# EAGLE design IV51 (EAGLE 6.1)
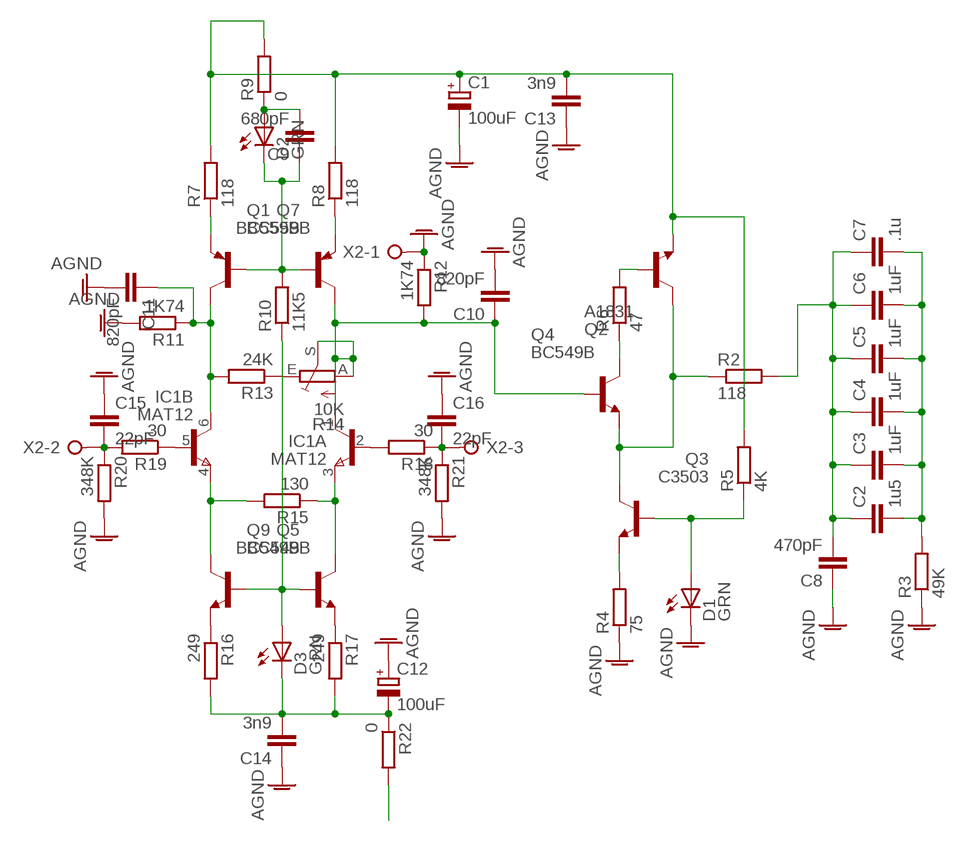
[diagram p0: schematic, sheet 1]

## Parts
C1  100uF  CPOL-EUE5-10.5  [E5-10,5]
C2  1u5  C-EU275-134X316  [C275-134X316]
C3  1uF  C-EU275-134X316  [C275-134X316]
C4  1uF  C-EU275-134X316  [C275-134X316]
C5  1uF  C-EU275-134X316  [C275-134X316]
C6  1uF  C-EU275-134X316  [C275-134X316]
C7  .1u  C-EU050-075X075  [C050-075X075]
C8  470pF  C-EU102-043X133  [C102-043X133]
C9  680pF  C-EU050-045X075  [C050-045X075]
C10  820pF  C-EU075-032X103  [C075-032X103]
C11  820pF  C-EU075-032X103  [C075-032X103]
C12  100uF  CPOL-EUE5-10.5  [E5-10,5]
C13  3n9  C-EUC1210  [C1210]
C14  3n9  C-EUC1210  [C1210]
C15  22pF  C-EU075-032X103  [C075-032X103]
C16  22pF  C-EU075-032X103  [C075-032X103]
D1  GRN  SFH482  [SFH482]
D2  GRN  SFH482  [SFH482]
D3  GRN  SFH482  [SFH482]
IC1  MAT12  MAT-02H  [TO78]
Q1  BC559B  BC559A  [TO92-EBC]
Q2  A1831  2N4923  [TO126]
Q3  C3503  2N4923  [TO126]
Q4  BC549B  [TO92-EBC]
Q5  BC549B  [TO92-EBC]
Q7  BC559B  BC559A  [TO92-EBC]
Q9  BC549B  [TO92-EBC]
R2  118  R-EU_0309/12  [0309/12]
R3  49K  R-EU_0309/12  [0309/12]
R4  75  R-EU_0309/12  [0309/12]
R5  4K  R-EU_0309/12  [0309/12]
R6  47  R-EU_0309/12  [0309/12]
R7  118  R-EU_0309/12  [0309/12]
R8  118  R-EU_0309/12  [0309/12]
R9  0  R-EU_0309/12  [0309/12]
R10  11K5  R-EU_0309/12  [0309/12]
R11  1K74  R-EU_0309/12  [0309/12]
R12  1K74  R-EU_0309/12  [0309/12]
R13  24K  R-EU_0309/12  [0309/12]
R14  10K  TRIM_EU-RJ9W  [RJ9W]
R15  130  R-EU_0309/12  [0309/12]
R16  249  R-EU_R2010  [R2010]
R17  249  R-EU_R2010  [R2010]
R18  30  R-EU_0309/12  [0309/12]
R19  30  R-EU_0309/12  [0309/12]
R20  348K  R-EU_R1210  [R1210]
R21  348K  R-EU_R1210  [R1210]
R22  0  R-EU_0309/12  [0309/12]
X2  W237-3E  [W237-3E]

## Nets
AGND: C1.- C8.1 C10.2 C11.2 C12.+ C13.1 C14.1 C15.1 C16.1 D1.K(C) R3.1 R4.1 R11.2 R12.1 R20.2 R21.2 X2.1
N$2: Q7.E R7.1
N$3: C2.1 C3.1 C4.1 C5.1 C6.1 C7.1 C8.2 R2.2
N$4: D1.A Q3.3(B) R5.1
N$5: C9.2 D2.A R9.1
N$6: Q2.3(B) R6.2
N$7: Q2.2(C) Q3.2(C) Q4.E R2.1
N$8: Q3.1(E) R4.2
N$9: C1.+ C13.2 Q2.1(E) R5.2 R7.2 R8.2 R9.2
N$10: Q4.C R6.1
N$11: Q1.E R8.1
N$12: C10.1 IC1.1(A:C) Q1.C Q4.B R12.2 R14.A R14.S
N$13: C11.1 IC1.6(B:C) Q7.C R11.1 R13.2
N$14: C9.1 D2.K(C) Q1.B Q7.B R10.2
N$15: R13.1 R14.E
N$16: IC1.4(B:E) Q5.C R15.2
N$17: IC1.3(A:E) Q9.C R15.1
N$18: Q5.E R16.1
N$19: Q9.E R17.1
N$20: C12.- C14.2 D3.K(C) R16.2 R17.2 R22.1
N$21: D3.A Q5.B Q9.B R10.1
N$22: IC1.2(A:B) R18.2
N$23: IC1.5(B:B) R19.1
N$24: C15.2 R19.2 R20.1 X2.2
N$25: C16.2 R18.1 R21.1 X2.3
N$28: R22.2
OUT: C2.2 C3.2 C4.2 C5.2 C6.2 C7.2 R3.2

## Library data of the parts
C1 C12 = resistor:CPOL-EU: POLARIZED CAPACITOR, European symbol
C2-C11 C13-C16 = resistor:C-EU: CAPACITOR, European symbol
D1-D3 = led:SFH482: IR LED infrared emitting diode, Infineon
IC1 = linear:MAT-02H: Dual TRANSISTOR
Q1 Q7 = transistor-pnp:BC559*: PNP Transistror
Q2 Q3 = transistor-npn:2N4923: NPN Transistor
Q4 Q5 Q9 = transistor-npn:BC549*: NPN Transistor
R2-R13 R15-R22 = resistor:R-EU_: RESISTOR, European symbol
R14 = pot:TRIM_EU-: POTENTIOMETER
X2 = con-wago-508:W237-3E: WAGO SREW CLAMP; OC_FARNELL: unknown; OC_NEWARK: unknown

## Board
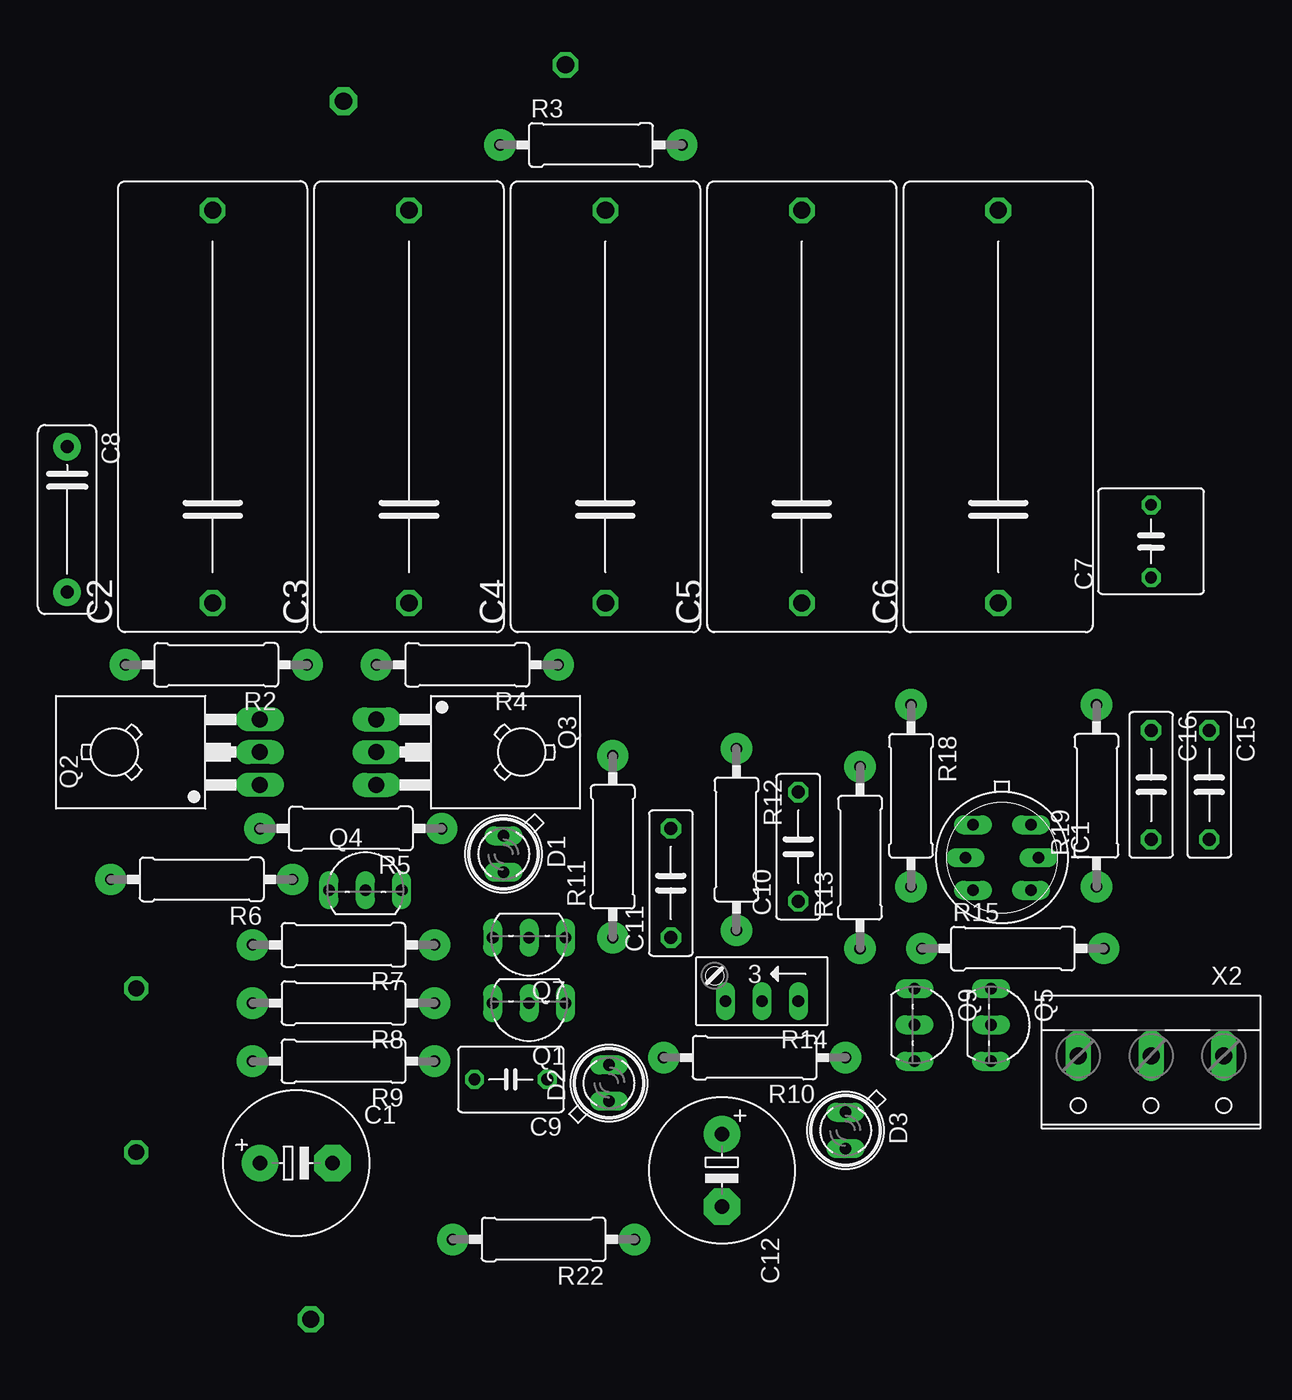
[diagram p1: board, top side]
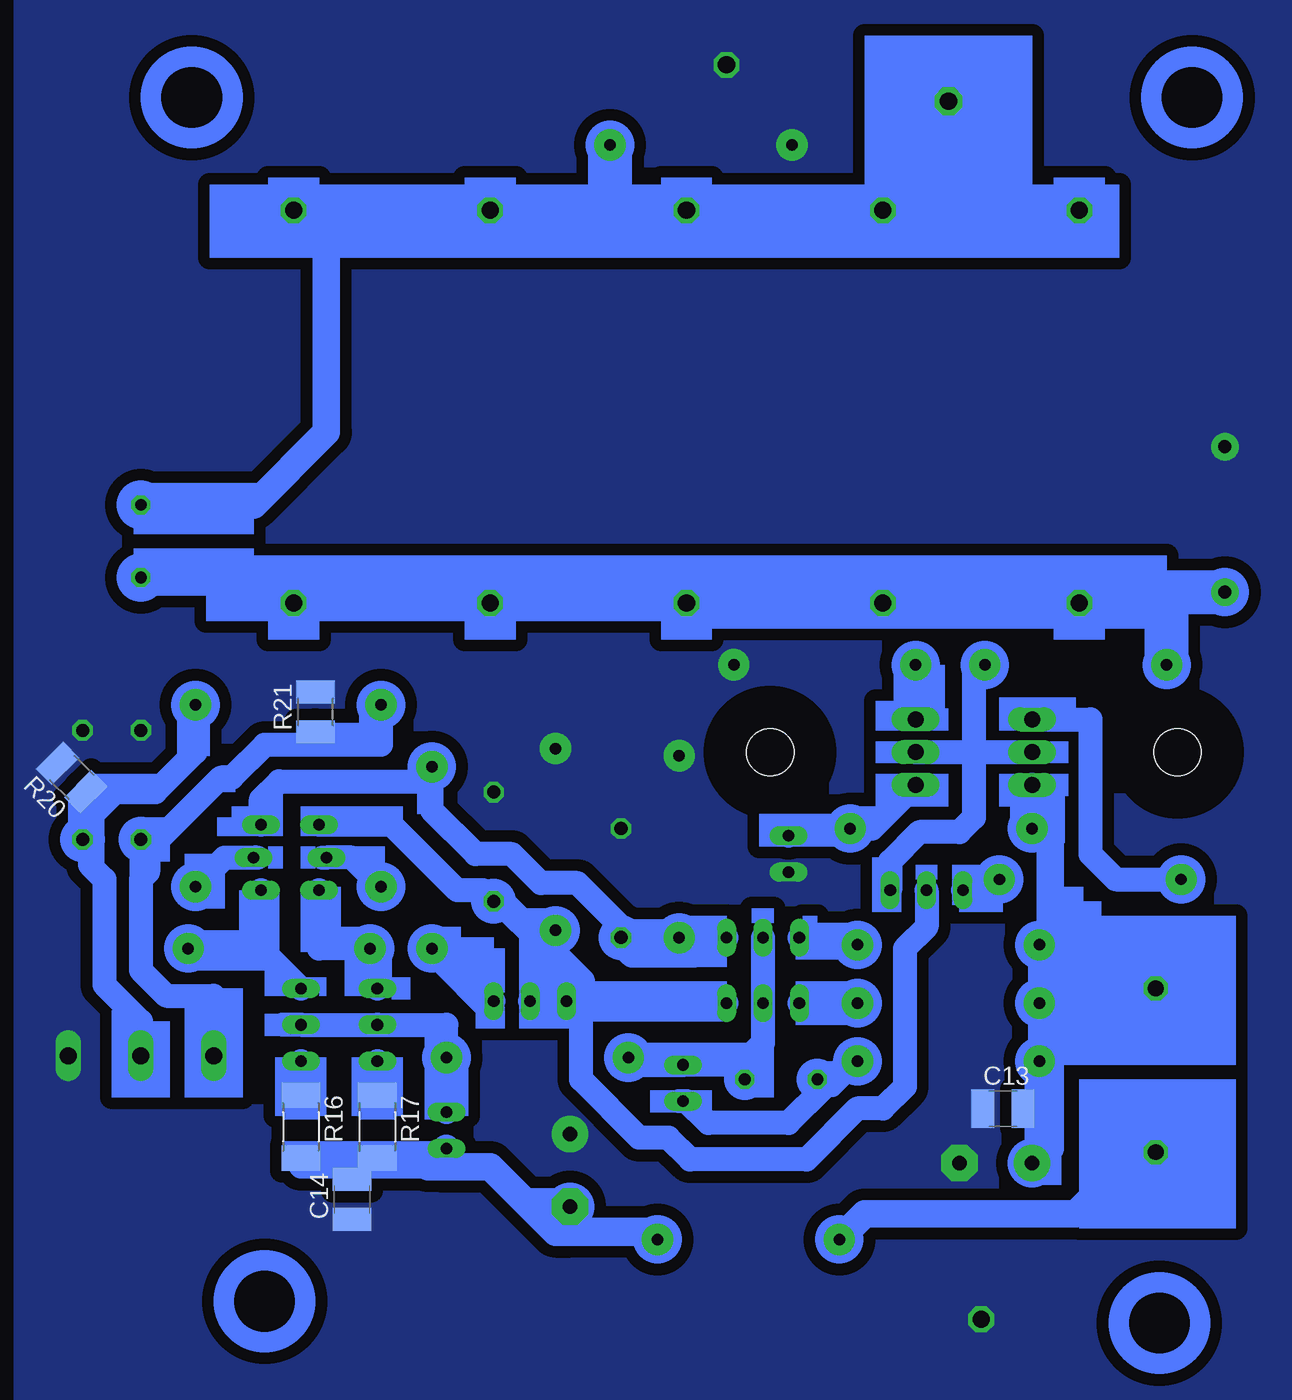
[diagram p2: board, bottom side, seen from below]

No outline drawn. Coordinates in mm, seen from the top.
Copper layers (1*16): Top 0.035mm / dielectric 1.5mm / Bottom 0.035mm
Design rules "default": minimum track width 10mil, minimum drill 24mil, track to track 8mil, track to pad 8mil, pad to pad 8mil, via to via 8mil, smd to smd 8mil, copper to edge 40mil, drill to drill 8mil, minimum pad ring 10mil, minimum via ring 8mil, stop-mask expansion 4mil, vias tented up to drill 0mil, thermal gap 10mil

### Footprints (pad centres in the part's own frame; a part is rotated, then mirrored left to right if it is on the bottom)
E5-10,5 = drill 1.016 pad 2.54: + -2.54,0 | drill 1.016 pad 2.54 octagon: - 2.54,0
C275-134X316 = drill 1.194 octagon: 1 -13.716,0; 2 13.716,0
C050-075X075 = drill 0.813 octagon: 1 -2.54,0; 2 2.54,0
C102-043X133 = drill 0.9 pad 1.93: 1 -5.08,0; 2 5.08,0
C050-045X075 = drill 0.813 octagon: 1 -2.54,0; 2 2.54,0
C075-032X103 = drill 0.914 octagon: 1 -3.81,0; 2 3.81,0
C1210 = smd 1.6 x 2.7: 1 -1.4,0; 2 1.4,0
SFH482 = drill 0.813 long: A -1.27,0; K 1.27,0
TO78 = drill 0.813 long: 1 -2.286,-2.032; 2 0,-2.54; 3 2.286,-2.032; 4 2.286,2.032; 5 0,2.54; 6 -2.286,2.032
TO92-EBC = drill 0.813 long: B 0,-1.27; C -2.54,-1.27; E 2.54,-1.27
TO126 = drill 1.118 long: 1 -2.286,-5.08; 2 0,-5.08; 3 2.286,-5.08 | hole 3.302: 0,5.08
0309/12 = drill 0.8 pad 2.184: 1 -6.35,0; 2 6.35,0
RJ9W = drill 0.813 long: A 2.54,0.635; E -2.54,0.635; S 0,0.635
R2010 = smd 1.8 x 2.7: 1 -2.2,0; 2 2.2,0
R1210 = smd 1.6 x 2.7: 1 -1.4,0; 2 1.4,0
W237-3E = drill 1.194 long: 1 -5.08,-0.635; 2 0,-0.635; 3 5.08,-0.635

### Placement (x,y rotation side)
C1  -104.39,44.45 0 top
C2  -110.24,97.28 90 top
C3  -96.52,97.28 90 top
C4  -82.8,97.28 90 top
C5  -69.09,97.28 90 top
C6  -55.37,97.28 90 top
C7  -44.7,87.88 90 top
C8  -120.4,89.41 270 top
C9  -89.41,50.29 180 top
C10  -69.34,66.55 90 top
C11  -78.23,64.01 90 top
C12  -74.68,43.94 270 top
C13  -104.9,48.26 0 bottom
C14  -59.44,41.91 90 bottom
C15  -40.64,70.87 270 top
C16  -44.7,70.87 270 top
D1  -89.92,66.04 270 top
D2  -82.55,50.04 90 top
D3  -66.04,46.74 270 top
IC1  -55.12,65.79 270 top
Q1  -88.14,54.36 180 top
Q2  -112.01,73.15 90 top
Q3  -93.73,73.15 270 top
Q4  -99.57,64.77 0 top
Q5  -54.61,54.1 270 top
Q7  -88.14,58.93 180 top
Q9  -59.94,54.1 270 top
R2  -109.98,79.25 180 top
R3  -83.82,115.57 0 top
R4  -92.46,79.25 180 top
R5  -100.58,67.82 180 top
R6  -111,64.26 180 top
R7  -101.09,59.69 180 top
R8  -101.09,55.63 180 top
R9  -101.09,51.56 180 top
R10  -72.39,51.82 180 top
R11  -82.3,66.55 90 top
R12  -73.66,67.06 270 top
R13  -65.02,65.79 90 top
R14  -71.88,56.39 180 top
R15  -54.36,59.44 0 top
R16  -55.88,46.99 270 bottom
R17  -61.21,46.99 270 bottom
R18  -61.47,70.1 270 top
R19  -48.51,70.1 90 top
R20  -39.88,71.37 134.9 bottom
R21  -56.9,75.95 90 bottom
R22  -87.12,39.12 180 top
X2  -44.7,51.31 180 top

### Tracks (layer width: path | path; a pad name or v marks a point on that pad's centre or on a via)
AGND  (via drill 1.2 pad 1.68)
  other vias: -103.38,33.53 -85.6,121.16
  pour Bottom (isolate 0.813, no thermals): -36.32,129.29 -66.8,129.29 -96.52,129.21 -125.98,129.29 -125.98,27.18 -36.32,27.43
N$1  (via drill 1.2 pad 1.93)
  other vias: -101.09,118.62
N$2
  Bottom 1.676: Q7.E -91.19,59.69 R7.1
N$3
  Bottom 1.93: C7.1 -53.59,85.34 C6.1 C5.1 C4.1 C3.1 C2.1 -111,84.33 -116.33,84.33 | -116.33,84.33 C8.2 -120.65,84.33 | R2.2 -116.33,84.33
N$4
  Bottom 1.676: Q3.3 -95.76,67.82 -94.49,67.82 R5.1 -90.42,67.82 D1.A
N$5
  Bottom 1.422: -92.46,49.78 -92.33,49.91 -94.23,51.82 -95,51.82 R9.1 -92.96,49.78 -92.46,49.78
  Bottom 1.676: -82.3,48.77 D2.A -82.8,48.77 -84.33,47.24 -89.92,47.24 -92.46,49.78 | C9.2 -92.33,49.91
N$6
  Bottom 1.676: Q2.3 -111,75.44 -111,66.04 -112.78,64.26 R6.2
N$7
  Bottom 1.676: Q3.2 -102.87,73.15 | -102.87,73.15 Q2.2 | R2.1 -102.87,78.49 -102.87,73.15 | -102.87,73.15 -102.87,68.58 -101.85,67.56 -99.06,67.56 -97.03,65.53 Q4.E
N$8
  Bottom 1.676: Q3.1 R4.2
N$9
  Bottom 1.422: C13.2 -108.2,48.26
  Bottom 1.676: R5.2 Q2.1
  Bottom 1.93: R5.2 -108.2,67.82 -108.2,59.69 | -108.2,59.69 -108.2,55.63 | -108.2,55.63 R8.2 | R7.2 -108.2,59.69 | -108.2,51.56 R9.2 -107.7,51.82 -108.2,51.82 | -108.2,51.56 -108.2,51.82 | -108.2,51.82 -108.2,55.63 | -108.2,51.56 -108.2,48.26 -108.2,45.47 C1.+
N$10
  Bottom 1.676: R6.1 -103.89,63.5 Q4.C
N$11
  Bottom 1.676: Q1.E R8.1
N$12
  Bottom 1.676: Q4.B -99.57,60.96 -98.04,59.44 -98.04,49.78 -96.52,48.26 -94.74,48.26 -91.19,44.7 -83.06,44.7 -81.53,46.23 -79.5,46.23 -75.44,50.29 -75.44,54.74 | -75.44,54.74 -75.44,55.37 | -85.34,55.63 Q1.C | R14.S -73.15,55.75 | -73.15,55.75 R14.A -75.44,54.74 | R12.2 -72.77,59.82 | -73.15,55.75 -73.28,55.63 -75.44,55.63 | -69.85,62.74 C10.1 -68.58,63.5 -66.8,63.5 -62.23,68.07 IC1.1
  Bottom 1.93: -69.85,62.74 -72.77,59.82 -75.44,57.15 -75.44,55.63 | -75.44,55.37 -75.44,55.63 | -75.44,55.63 -85.34,55.63
N$13
  Bottom 1.676: Q7.C -84.58,60.2 -83.31,58.93 -82.3,58.93 | -82.3,58.93 -78.99,58.93 -78.23,59.69 C11.1 | -82.3,59.44 R11.1 C11.1 | -82.3,59.44 -82.3,58.93 | C11.1 -82.55,60.2 | -82.3,59.44 -81.79,59.94 -78.74,59.94 -78.23,60.45 -78.23,60.96 -75.18,64.01 -72.64,64.01 -70.61,66.04 -68.07,66.04 -65.02,69.09 -65.02,71.12 | IC1.6 -53.09,69.85 -54.36,71.12 -65.02,71.12 | -65.02,71.12 R13.2
N$14
  Bottom 1.676: C9.1 -85.85,51.31 | -85.85,51.31 D2.K -79.25,51.31 R10.2 | -85.85,51.31 -86.61,51.31 -88.14,52.83 Q1.B Q7.B
N$15
  Bottom 1.676: R13.1 -65.79,58.42 -68.83,55.37 R14.E
N$16
  Bottom 1.676: R15.2 -53.09,59.44 | -53.09,59.44 IC1.4 | -53.09,59.44 Q5.C
N$17
  Bottom 1.676: IC1.3 -57.15,59.44 R15.1 -61.21,58.93 Q9.C
N$18
  Bottom 1.676: Q5.E R16.1 -55.88,48.51
N$19
  Bottom 1.676: R17.1 Q9.E R17.1 | R17.1 -61.21,48.77 -61.21,48.51
N$20
  Bottom 1.422: C14.2 -59.69,43.56 -59.69,44.45 -65.02,44.45 -65.02,43.94 -66.29,43.94 -66.04,44.2
  Bottom 1.676: D3.K -65.02,44.45 -64.77,44.2 -61.47,44.2 | -61.47,44.2 -55.88,44.2 R16.2 | R17.2 -61.47,44.54 -61.47,44.2
  Bottom 1.93: D3.K -66.04,44.2 -65.79,44.45 | -65.79,44.7 -65.79,44.45 | -65.79,44.45 -65.53,44.2 | -65.53,44.2 -64.77,44.2 | -65.53,44.2 -69.09,44.2 -73.66,39.62 -74.68,39.62 | C12.- -74.68,39.62 | R22.1 -80.26,39.62 -74.68,39.62
N$21
  Bottom 1.676: -54.61,54.1 Q5.B Q9.B -66.04,54.1 R10.1 D3.A
N$22
  Bottom 1.676: R18.2 -59.44,65.79 IC1.2 -57.4,65.79
N$23
  Bottom 1.676: R19.1 -50.55,65.79 IC1.5 -52.83,65.79
N$24
  Bottom 1.676: -41.15,67.56 -41.15,68.58 -42.93,70.36 | -41.15,67.56 -41.15,65.28 -42.16,64.26 -42.16,56.9 -44.7,54.36 X2.2 | -42.93,70.36 -45.72,70.36 -48.51,73.15 R19.2 | -42.93,70.36 -42.65,70.64 R20.1 | C15.2 -41.15,67.56
N$25
  Bottom 1.676: R18.1 -61.47,73.66 -56.64,73.66 | -45.34,66.42 -50.29,71.37 -51.05,71.37 -53.34,73.66 -56.64,73.66 | -45.34,66.42 -45.21,66.29 -45.21,64.77 -44.7,64.26 -44.7,57.91 -46.48,56.13 -49.78,56.13 X2.3 | R21.1 -56.9,73.91 -56.64,73.66 | C16.2 -45.34,66.42
N$26  (via drill 1.1 pad 1.68)
  other vias: -115.57,56.64
N$28  (via drill 1.1 pad 1.68)
  Bottom 1.93: R22.2 -95.25,40.89 -109.98,40.89 -114.3,45.21 v-115.57,45.21
OUT
  Bottom 1.422: R3.2 -77.47,111.25 -77.72,111 -84.07,111
  Bottom 1.676: C3.2 -96.52,111.25
  Bottom 1.93: C2.2 C3.2 | -96.01,111 C3.2 | -84.58,111 C3.2 | -85.85,111.51 -77.47,111.25 C5.2 -57.66,111 | -57.66,111 C6.2 | C7.2 -52.58,90.42 -57.66,95.5 -57.66,111
  Bottom 2.184: -84.58,111 -84.33,111 -84.07,111 C4.2 -85.85,111.51
(copper drawn outside any net)
  shapes: Bottom area x169, Bottom circle x47